# EAGLE schematic module (EAGLE 9.3.0)

## Sheet 1 of 3
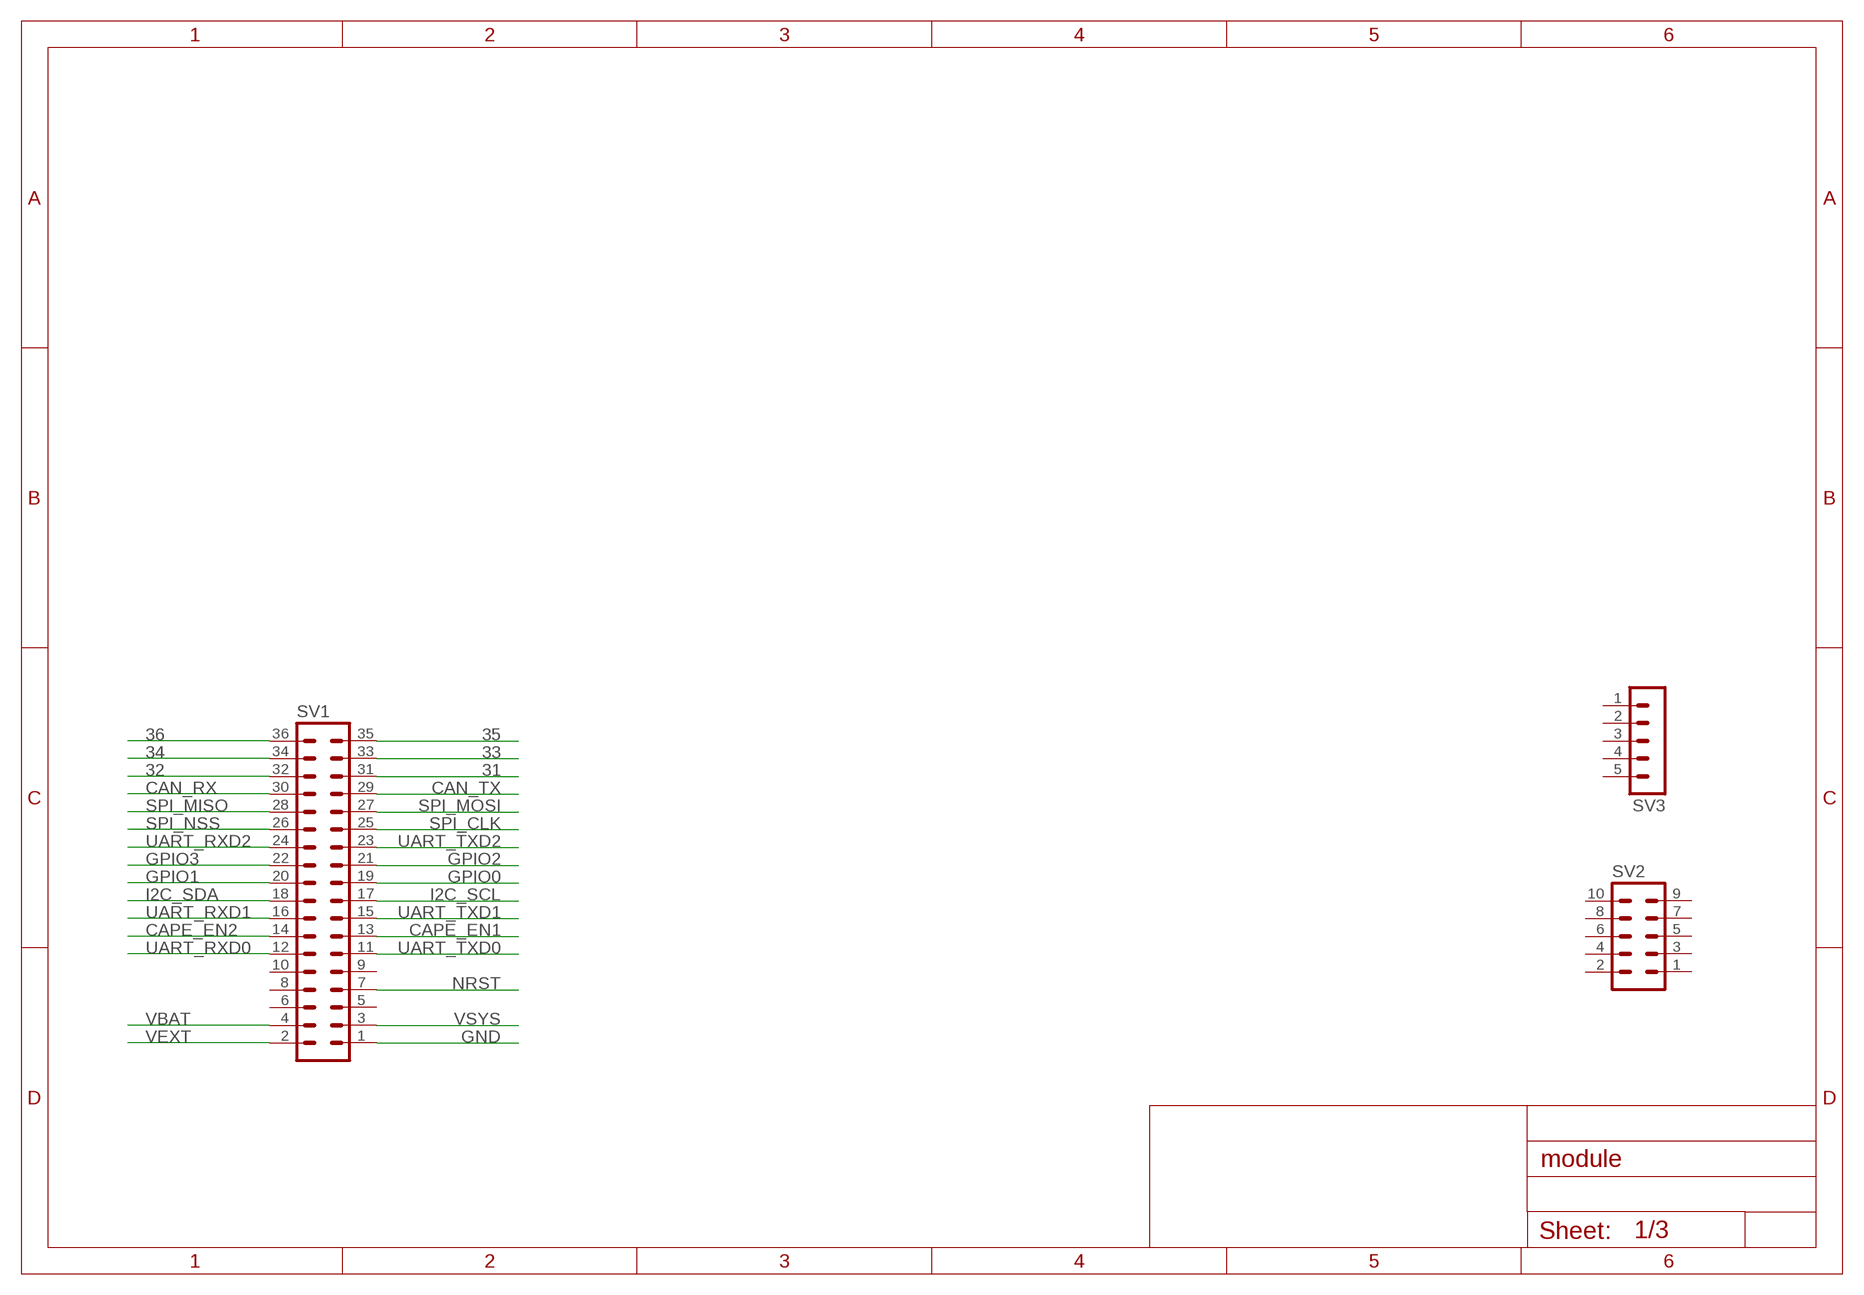
[diagram p0: schematic, sheet 1]

### Parts
SV1  MA18-2  [MA18-2]
SV2  MA05-2  [MA05-2]
SV3  MA05-1  [MA05-1]

### Nets
31: SV1.31
32: SV1.32
33: SV1.33
34: SV1.34
35: SV1.35
36: SV1.36
CAN_RX: SV1.30
CAN_TX: SV1.29
CAPE_EN1: SV1.13
CAPE_EN2: SV1.14
GND: SV1.1 ; also sheet 2
GPIO0: SV1.19
GPIO1: SV1.20
GPIO2: SV1.21
GPIO3: SV1.22
I2C_SCL: SV1.17
I2C_SDA: SV1.18
NRST: SV1.7
SPI_CLK: SV1.25
SPI_MISO: SV1.28
SPI_MOSI: SV1.27
SPI_NSS: SV1.26
UART_RXD0: SV1.12
UART_RXD1: SV1.16
UART_RXD2: SV1.24
UART_TXD0: SV1.11
UART_TXD1: SV1.15
UART_TXD2: SV1.23
VBAT: SV1.4
VEXT: SV1.2
VSYS: SV1.3
Unconnected: SV1.5 SV1.6 SV1.8 SV1.9 SV1.10 SV2.1 SV2.2 SV2.3 SV2.4 SV2.5 SV2.6 SV2.7 SV2.8 SV2.9 SV2.10 SV3.1 SV3.2 SV3.3 SV3.4 SV3.5

## Sheet 2 of 3
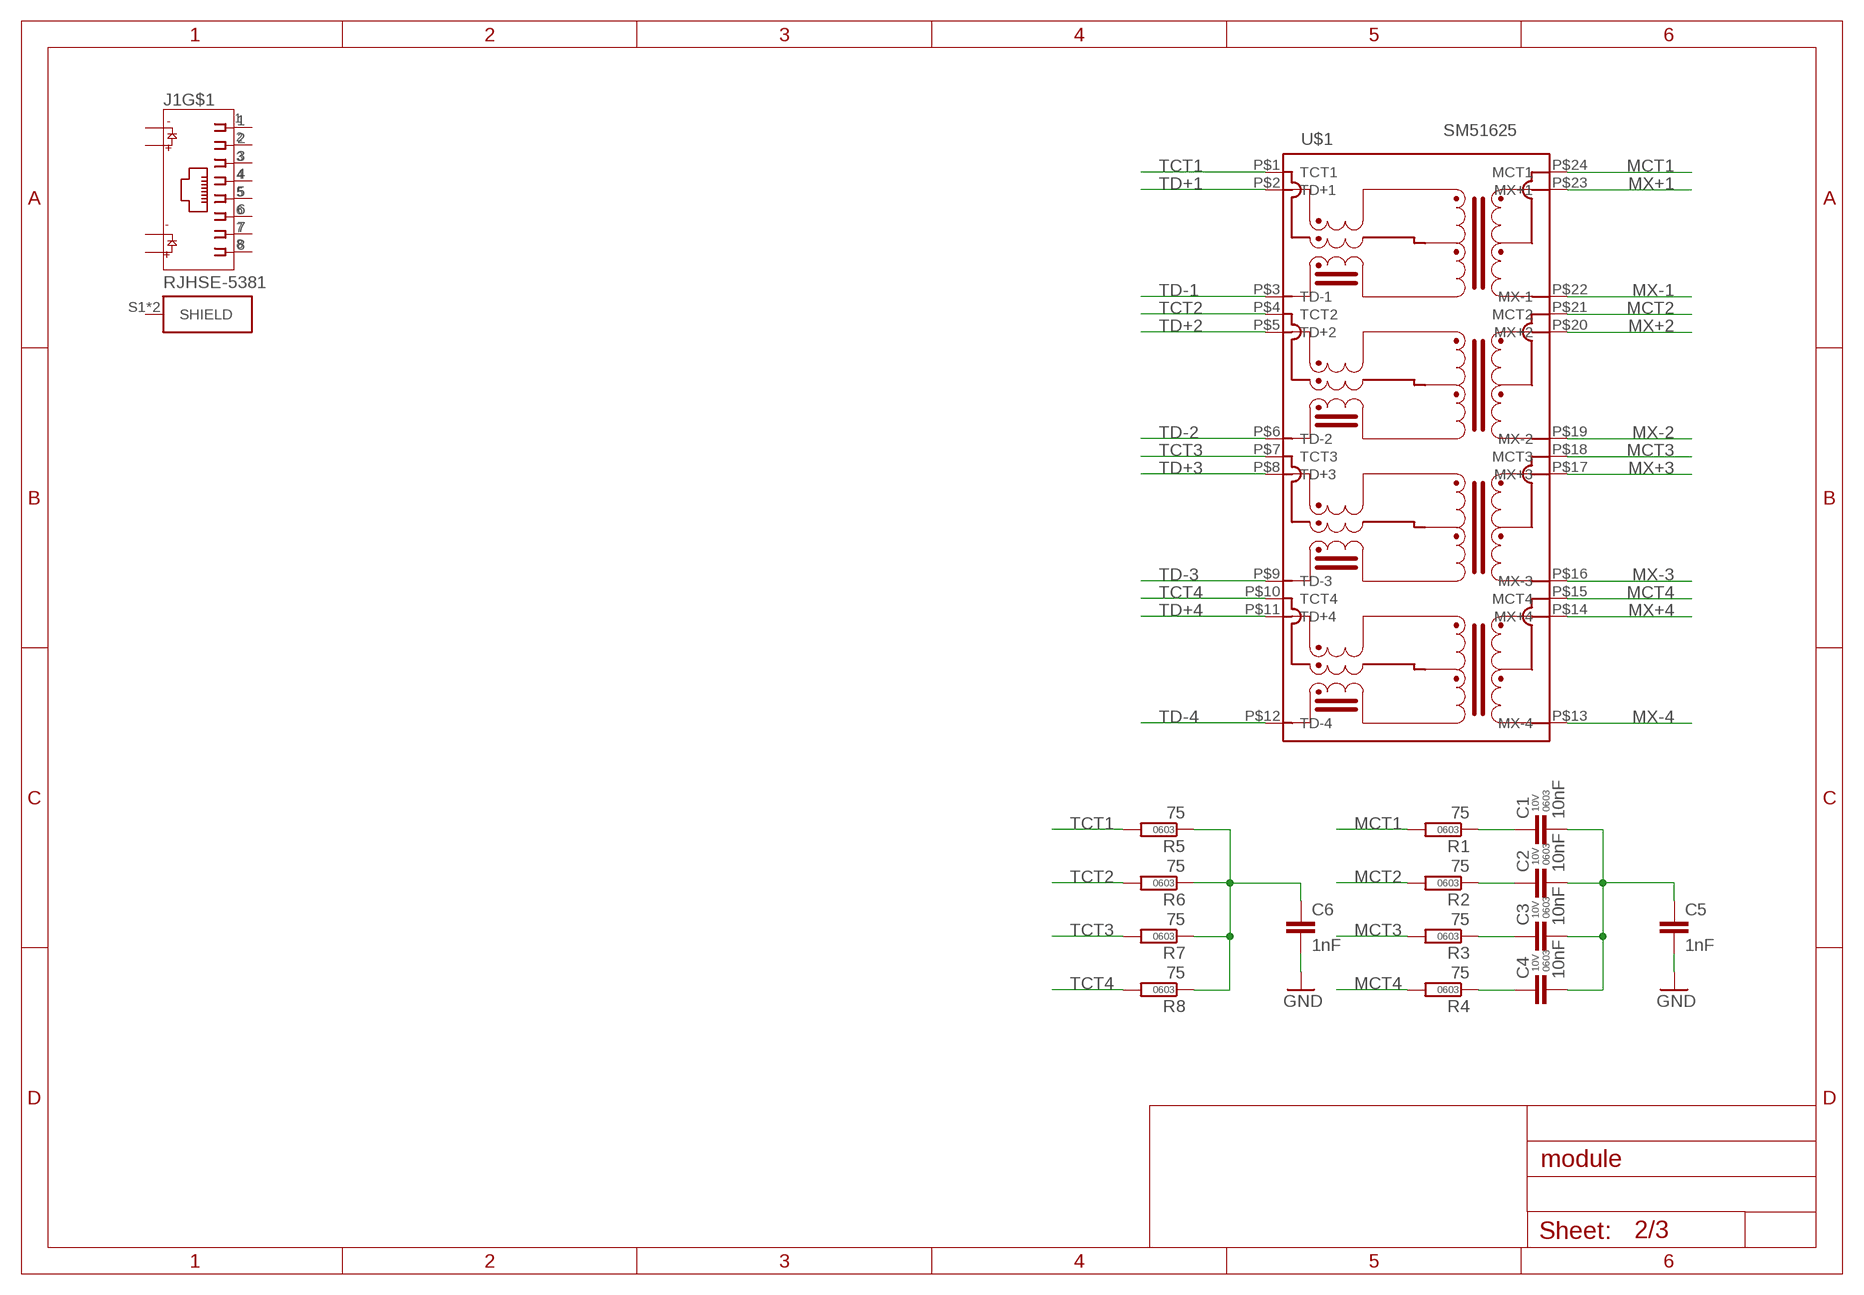
[diagram p1: schematic, sheet 2]

### Parts
C1  10nF  CAP-0603  [C0603]
C2  10nF  CAP-0603  [C0603]
C3  10nF  CAP-0603  [C0603]
C4  10nF  CAP-0603  [C0603]
C5  1nF  C-EUC1206  [C1206]
C6  1nF  C-EUC1206  [C1206]
J1  RJHSE-5381  [AMPHENOL_RJHSE-5381]
R1  75  RES-0603  [R0603]
R2  75  RES-0603  [R0603]
R3  75  RES-0603  [R0603]
R4  75  RES-0603  [R0603]
R5  75  RES-0603  [R0603]
R6  75  RES-0603  [R0603]
R7  75  RES-0603  [R0603]
R8  75  RES-0603  [R0603]
U$1  SM51625  [SM61625EL]

### Nets
GND: C5.2 C6.2 ; also sheet 1
MCT1: R1.2 U$1.P$24(MCT1)
MCT2: R2.2 U$1.P$21(MCT2)
MCT3: R3.2 U$1.P$18(MCT3)
MCT4: R4.2 U$1.P$15(MCT4)
MX+1: U$1.P$23(MX+1)
MX+2: U$1.P$20(MX+2)
MX+3: U$1.P$17(MX+3)
MX+4: U$1.P$14(MX+4)
MX-1: U$1.P$22(MX-1)
MX-2: U$1.P$19(MX-2)
MX-3: U$1.P$16(MX-3)
MX-4: U$1.P$13(MX-4)
N$2: C1.1 R1.1
N$3: C1.2 C2.2 C3.2 C4.2 C5.1
N$4: C6.1 R5.1 R6.1 R7.1 R8.1
N$5: C2.1 R2.1
N$8: C3.1 R3.1
N$11: C4.1 R4.1
TCT1: R5.2 U$1.P$1(TCT1)
TCT2: R6.2 U$1.P$4(TCT2)
TCT3: R7.2 U$1.P$7(TCT3)
TCT4: R8.2 U$1.P$10(TCT4)
TD+1: U$1.P$2(TD+1)
TD+2: U$1.P$5(TD+2)
TD+3: U$1.P$8(TD+3)
TD+4: U$1.P$11(TD+4)
TD-1: U$1.P$3(TD-1)
TD-2: U$1.P$6(TD-2)
TD-3: U$1.P$9(TD-3)
TD-4: U$1.P$12(TD-4)
Unconnected: J1.1 J1.2 J1.3 J1.4 J1.5 J1.6 J1.7 J1.8 J1.9 J1.10 J1.11 J1.12 J1.S1(SHIELD) J1.S2(SHIELD)

## Sheet 3 of 3
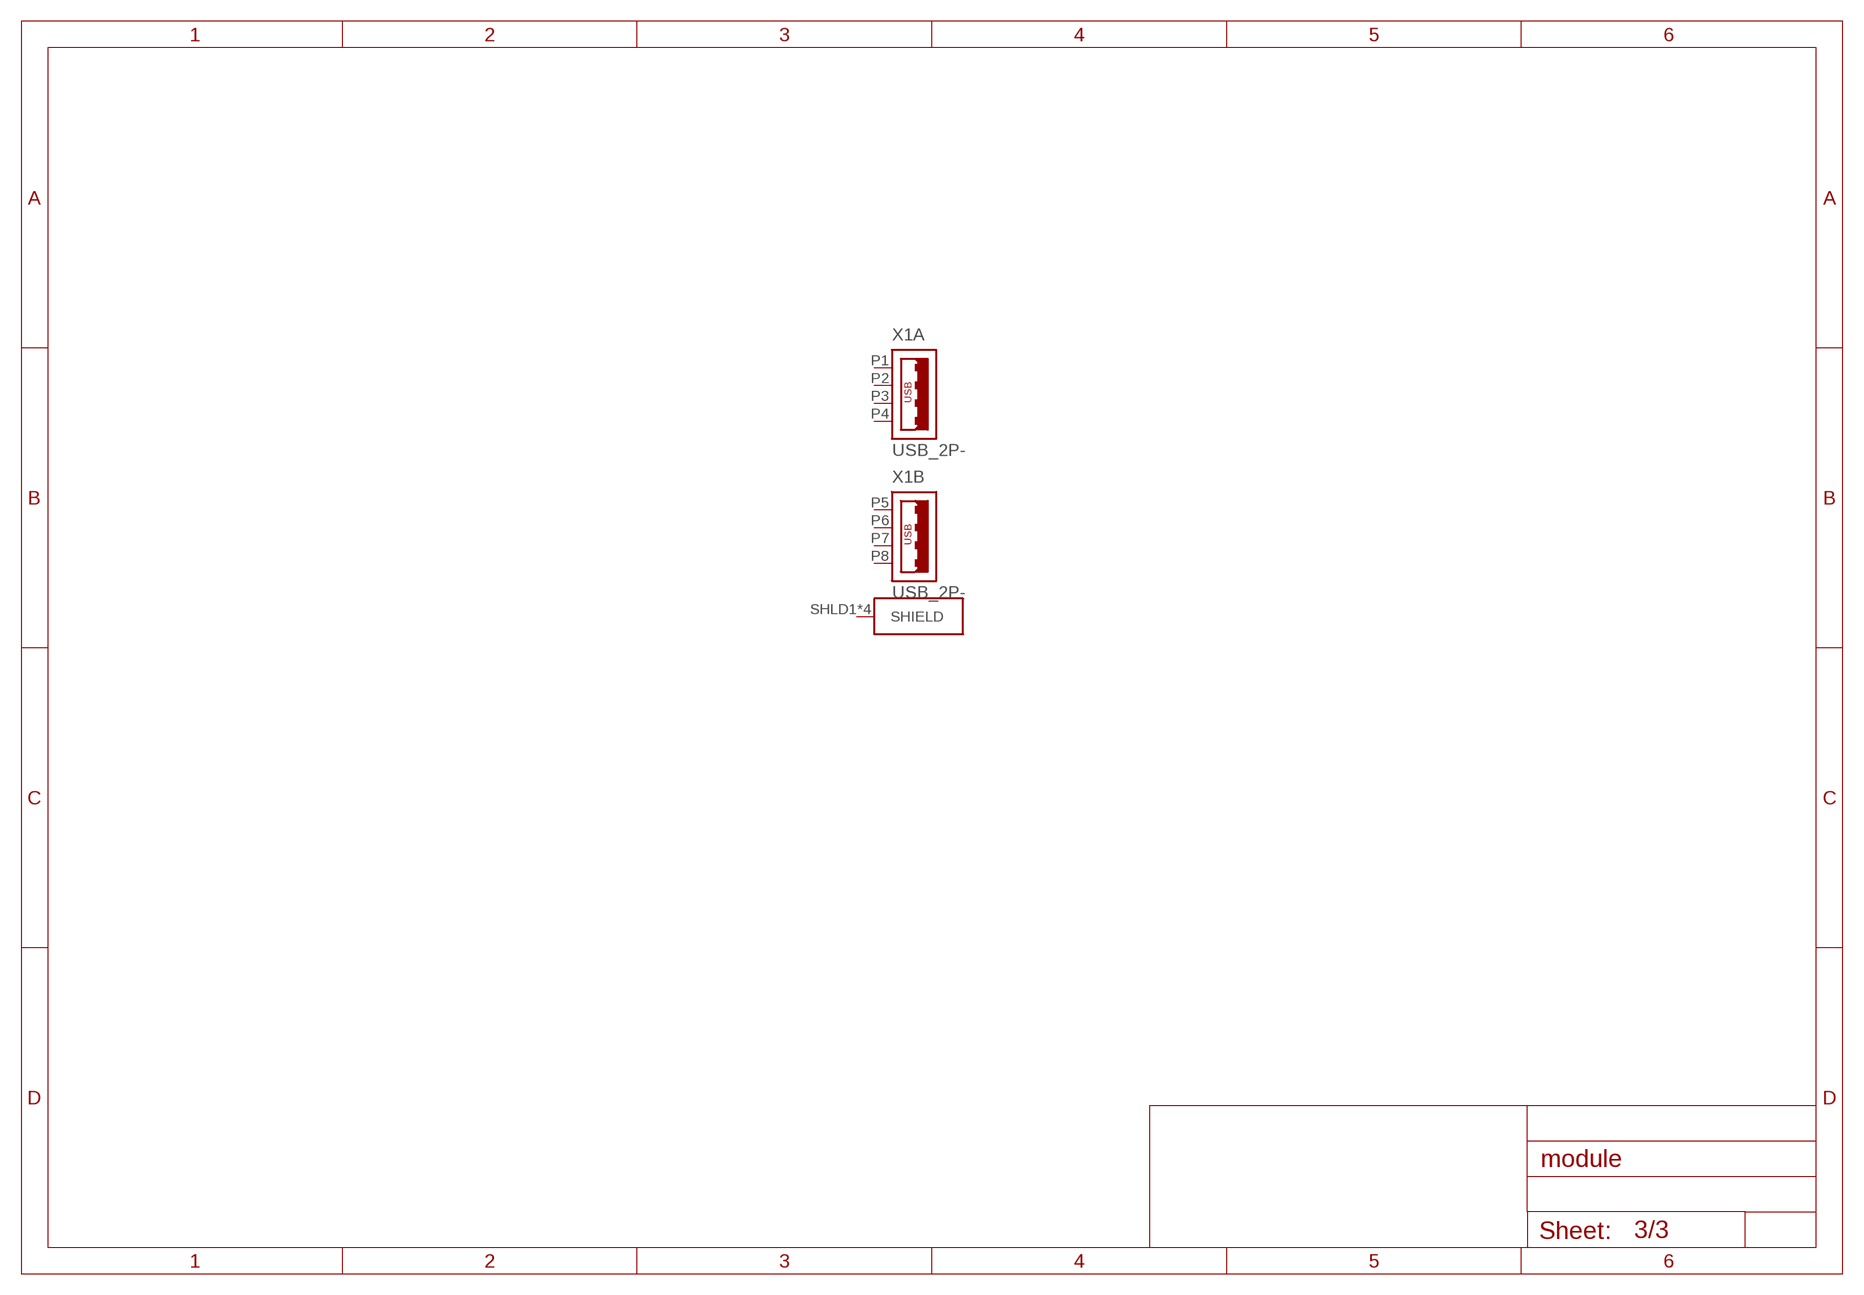
[diagram p2: schematic, sheet 3]

### Parts
X1  USB_2P-  [DS1096]
Unconnected: X1.P1 X1.P2 X1.P3 X1.P4 X1.P5 X1.P6 X1.P7 X1.P8 X1.SHLD1(SHIELD) X1.SHLD2(SHIELD) X1.SHLD3(SHIELD) X1.SHLD4(SHIELD)

## Library data of the parts
C1-C4 = parts-passives:CAP-; PACKAGE: 0603; RATING: 10V
C5 C6 = rcl:C-EU: CAPACITOR, European symbol; SPICEPREFIX: C
J1 = parts-amphenol:RJHSE-5381: connector, mod jack, rt angle pcb, shielded, led1-g, led2-y, single port, rj-45 8 cont; AVAILABILITY: Unavailable; DESCRIPTION: connector, mod jack, rt angle pcb, shielded, led1-g, led2-y, single port, rj-45 8 cont; MF: Amphenol ICC; MP: RJHSE-5381; PACKAGE: None; PRICE: None
R1-R8 = parts-passives:RES-; PACKAGE: 0603
SV1 = con-lstb:MA18-2: PIN HEADER; OC_FARNELL: unknown; OC_NEWARK: unknown
SV2 = con-lstb:MA05-2: PIN HEADER; OC_FARNELL: unknown; OC_NEWARK: unknown
SV3 = con-lstb:MA05-1: PIN HEADER; OC_FARNELL: unknown; OC_NEWARK: unknown
U$1 = parts-bourns:SM51625
X1 = parts-amphenol:USB_2P-: Dual USB Connector